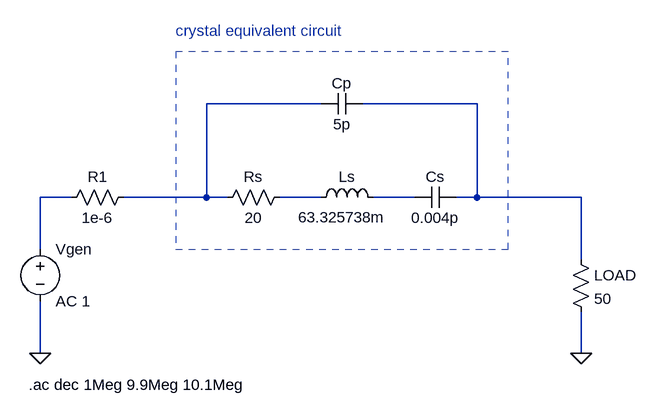
[diagram p0: schematic crystal-equivalent-circuit.asc]
crystal-equivalent-circuit.asc, the LTspice schematic file:
Version 4
SHEET 1 1452 680
WIRE 112 -320 -64 -320
WIRE 352 -320 176 -320
WIRE -272 -176 -320 -176
WIRE -64 -176 -64 -320
WIRE -64 -176 -192 -176
WIRE -32 -176 -64 -176
WIRE 112 -176 48 -176
WIRE 256 -176 192 -176
WIRE 352 -176 352 -320
WIRE 352 -176 320 -176
WIRE 512 -176 352 -176
WIRE -320 -96 -320 -176
WIRE 512 -80 512 -176
WIRE -320 64 -320 -16
WIRE 512 64 512 0
FLAG -320 64 0
FLAG 512 64 0
SYMBOL voltage -320 -112 R0
SYMATTR InstName Vgen
SYMATTR Value AC 1
SYMBOL res -176 -192 R90
WINDOW 0 0 56 VBottom 2
WINDOW 3 32 56 VTop 2
SYMATTR InstName R1
SYMATTR Value 1e-6
SYMBOL res 64 -192 R90
WINDOW 0 0 56 VBottom 2
WINDOW 3 32 56 VTop 2
SYMATTR InstName Rs
SYMATTR Value 20
SYMBOL ind 96 -160 R270
WINDOW 0 32 56 VTop 2
WINDOW 3 1 48 VBottom 2
SYMATTR InstName Ls
SYMATTR Value 63.325738m
SYMBOL cap 320 -192 R90
WINDOW 0 0 32 VBottom 2
WINDOW 3 32 32 VTop 2
SYMATTR InstName Cs
SYMATTR Value 0.004p
SYMBOL cap 176 -336 R90
WINDOW 0 0 32 VBottom 2
WINDOW 3 32 32 VTop 2
SYMATTR InstName Cp
SYMATTR Value 5p
SYMBOL res 496 -96 R0
SYMATTR InstName LOAD
SYMATTR Value 50
TEXT -338 112 Left 2 !.ac dec 1Meg 9.9Meg 10.1Meg
TEXT -112 -432 Left 2 ;crystal equivalent circuit
RECTANGLE Normal 400 -400 -112 -96 2

The netlist it stands for:
* crystal-equivalent-circuit.asc
Vgen N003 0 AC 1
R1 N001 N003 1e-6
Rs N004 N001 20
Ls N004 N005 63.325738m
Cs N002 N005 0.004p
Cp N002 N001 5p
R§LOAD N002 0 50
.ac dec 1Meg 9.9Meg 10.1Meg
* crystal equivalent circuit
.backanno
.end